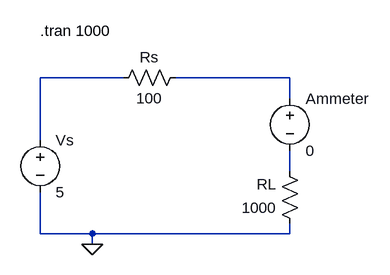
[diagram p0: schematic prelab1_part1b.asc]
prelab1_part1b.asc, the LTspice schematic file:
Version 4
SHEET 1 880 680
WIRE 128 32 0 32
WIRE 384 32 208 32
WIRE 384 64 384 32
WIRE 0 128 0 32
WIRE 384 176 384 144
WIRE 0 272 0 208
WIRE 80 272 0 272
WIRE 384 272 384 256
WIRE 384 272 80 272
WIRE 80 288 80 272
FLAG 80 288 0
SYMBOL res 224 16 R90
WINDOW 0 0 56 VBottom 2
WINDOW 3 32 56 VTop 2
SYMATTR InstName Rs
SYMATTR Value 100
SYMBOL res 400 272 R180
WINDOW 0 36 76 Left 2
WINDOW 3 36 40 Left 2
SYMATTR InstName RL
SYMATTR Value 1000
SYMBOL voltage 0 112 R0
WINDOW 123 0 0 Left 0
WINDOW 39 0 0 Left 0
SYMATTR InstName Vs
SYMATTR Value 5
SYMBOL voltage 384 48 R0
WINDOW 123 0 0 Left 0
WINDOW 39 0 0 Left 0
SYMATTR InstName Ammeter
SYMATTR Value 0
TEXT 0 -40 Left 2 !.tran 1000

The netlist it stands for:
* prelab1_part1b.asc
Rs N002 N001 100
RL 0 N003 1000
Vs N001 0 5
V§Ammeter N002 N003 0
.tran 1000
.backanno
.end